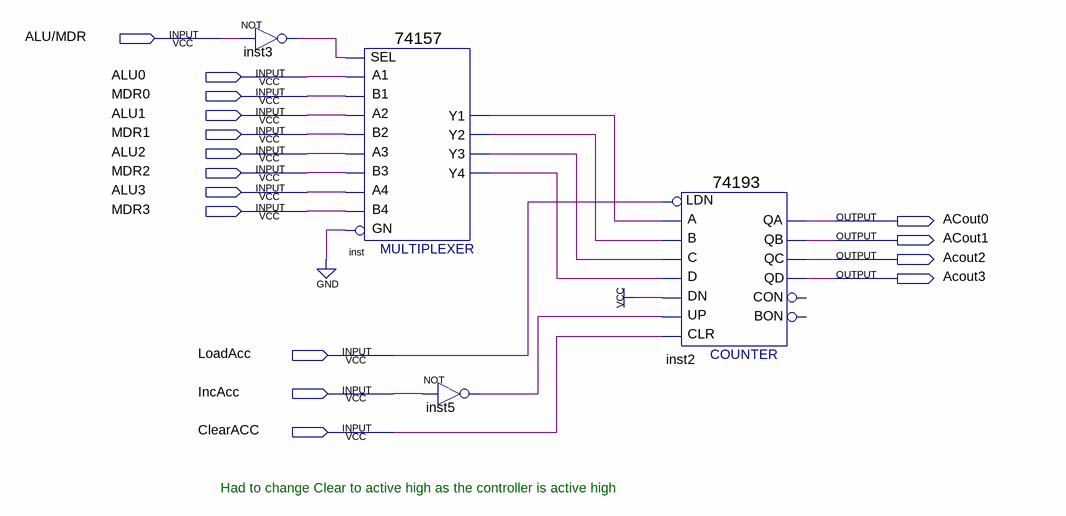
[diagram p0: schematic sheet]
// Quartus schematic Accumulator.bdf as structural Verilog: 4 symbols, 16 pins
module Accumulator (
  input  \ALU/MDR ,
  input  ALU0,
  input  MDR0,
  input  ALU1,
  input  MDR1,
  input  ALU2,
  input  MDR2,
  input  ALU3,
  input  MDR3,
  input  LoadAcc,
  input  IncAcc,
  input  ClearACC,
  output ACout0,
  output ACout1,
  output Acout2,
  output Acout3
);

  wire inst3_out, inst5_out, inst_y1, inst_y2, inst_y3, inst_y4;

  not inst3 (inst3_out, \ALU/MDR );
  \74157  inst (
    .A1(ALU0), .B1(MDR0), .SEL(inst3_out), .B2(MDR1), .A3(ALU2), .B3(MDR2), .A2(ALU1), .B4(MDR3), .GN(1'b0),
    .A4(ALU3), .Y2(inst_y2), .Y1(inst_y1), .Y4(inst_y4), .Y3(inst_y3));
  not inst5 (inst5_out, IncAcc);
  \74193  inst2 (
    .D(inst_y4), .C(inst_y3), .B(inst_y2), .A(inst_y1), .CLR(ClearACC), .UP(inst5_out), .DN(1'b1),
    .LDN(LoadAcc), .QB(ACout1), .QA(ACout0), .QD(Acout3), .QC(Acout2));  // open: CON, BON

  // Notes on the sheet:
  //   Had to change Clear to active high as the controller is active high
endmodule
